# Altium schematic sheet ui.SchDoc
size B; SheetNumber: 6; SheetTotal: 6
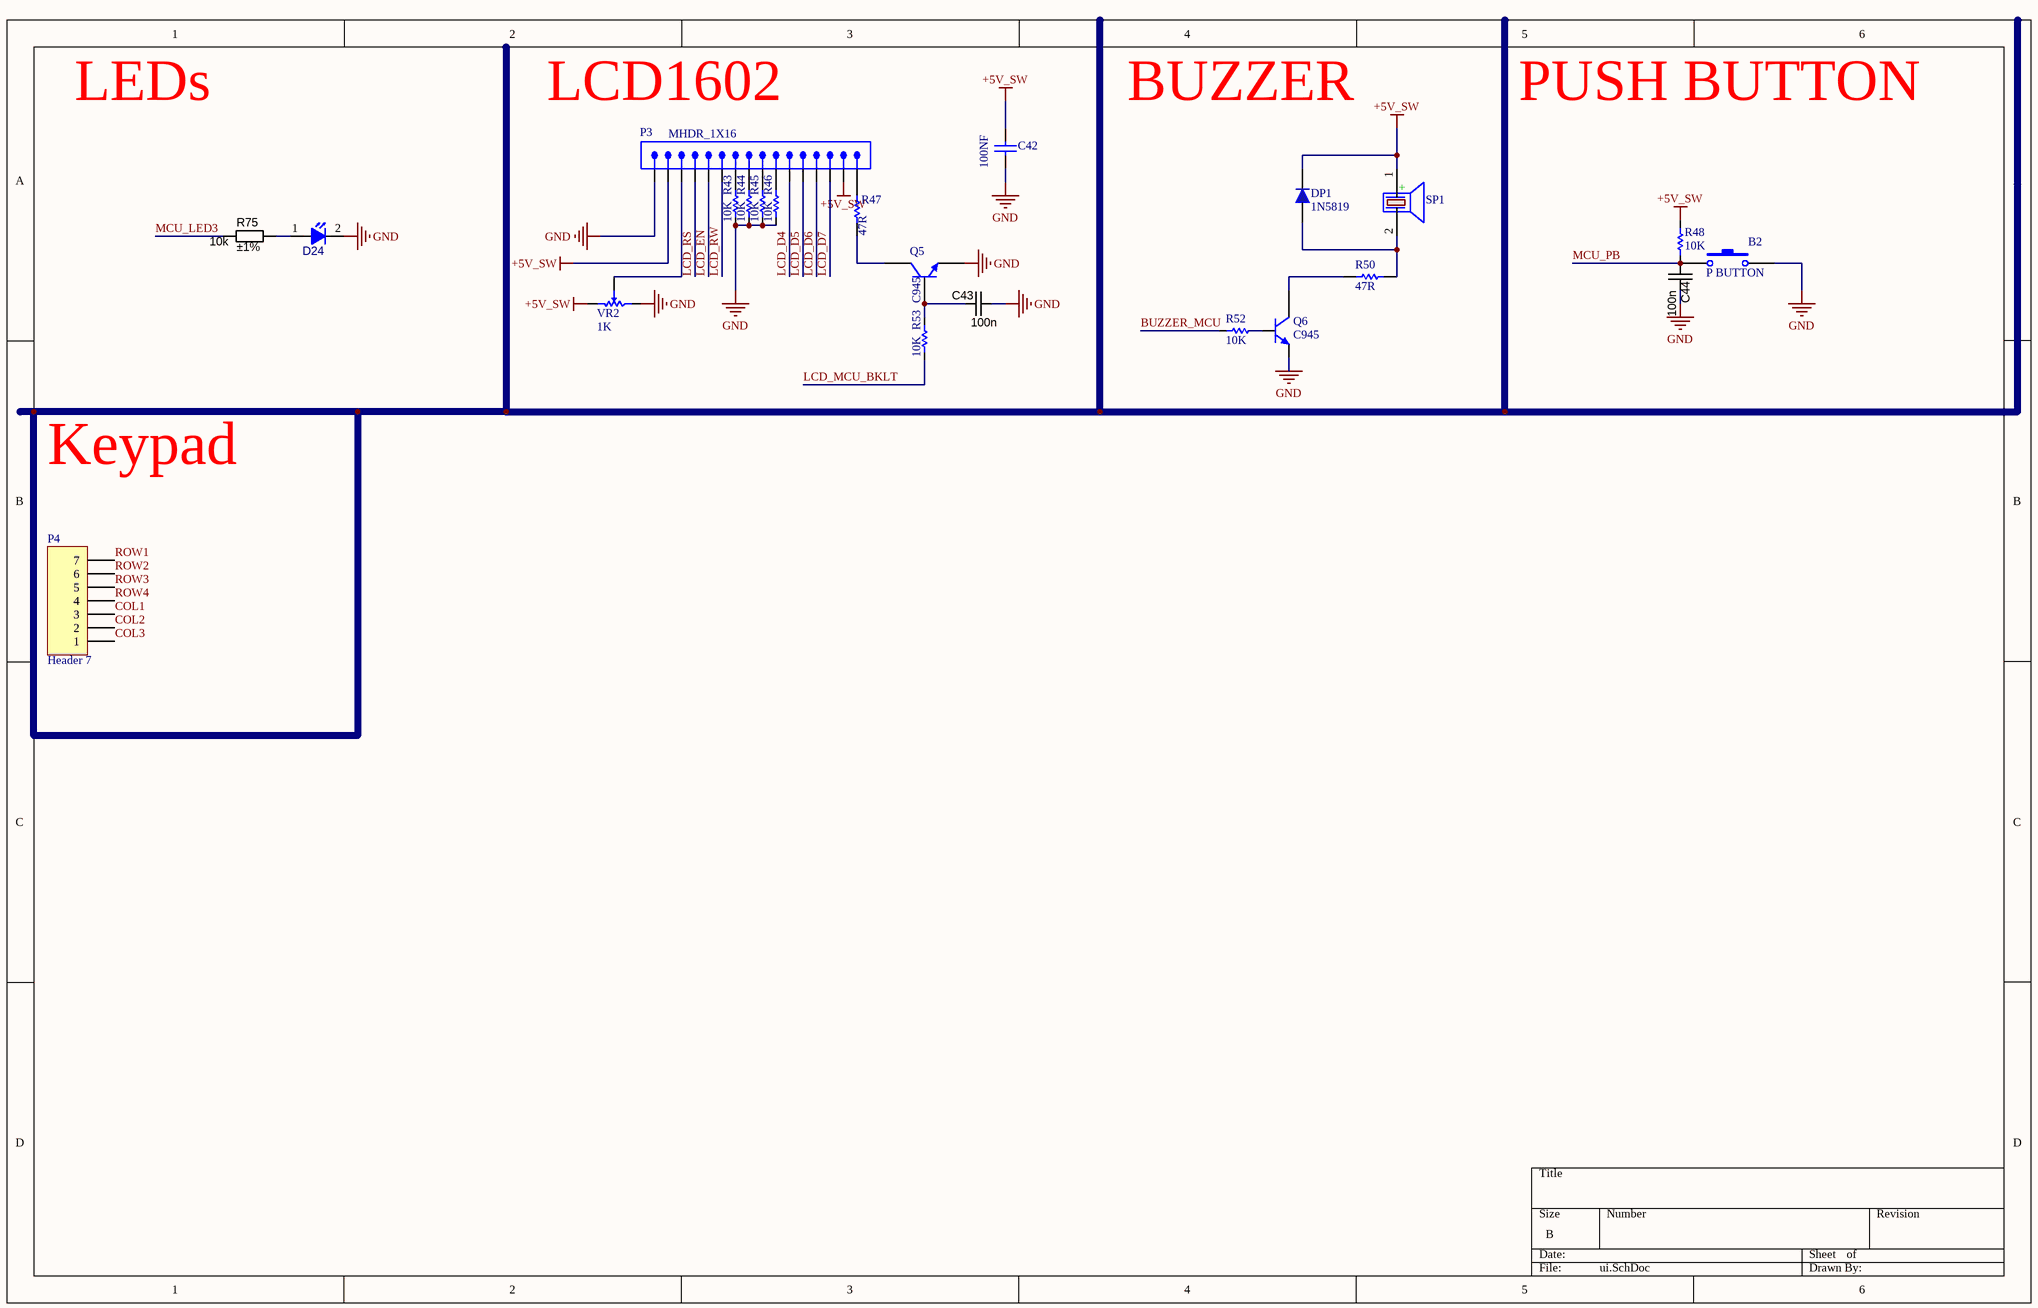
[diagram p0: ui.SchDoc]

## Parts
B2  P BUTTON  [MY_SPST-0.5]
C42  100NF  [CAP0603]
C43  value 100n  [CAPC2012X135N]  (hidden comment: approved sub OK)
C44  value 100n  [CAPC2012X135N]  (hidden comment: approved sub OK)
D24  LED SMD 0603  [LED SMD 0603 2 (Green)]  (value not drawn)
DP1  1N5819  [430X270D]
P3  MHDR_1X16  [MHDR1X16-254P]
P4  Header 7  [HDR1X7]
Q5  C945  [SOT23_N]
Q6  C945  [SOT23_N]
R43  10K  [RES 0603 (1608X06L)]
R44  10K  [RES 0603 (1608X06L)]
R45  10K  [RES 0603 (1608X06L)]
R46  10K  [RES 0603 (1608X06L)]
R47  47R  [RES1206]
R48  10K  [RES 0603 (1608X06L)]
R50  47R  [RES1206]
R52  10K  [RES 0603 (1608X06L)]
R53  10K  [RES 0603 (1608X06L)]
R75  10k  Tolerance: ±1%  [RESC1608X55N]
SP1  (no value)  [BUZZER 7.62mm DC]
VR2  value 1K  [Multi Turn]  (hidden comment: Multi Turn)

## Nets
+5V_SW: C42.2 DP1.2 P3.2 P3.15 R48.1 SP1.1(+) VR2.2(CW)
GND: B2.2 C42.1 C43.1 C44.1 D24.2(CATHODE) P3.1 Q5.2(E) Q6.2(E) R43.1 R44.1 R45.1 R46.1 VR2.1(CCW)
BUZZER_MCU: R52.1
COL1: P4.3
COL2: P4.2
COL3: P4.1
LCD_D4: P3.11
LCD_D5: P3.12
LCD_D6: P3.13
LCD_D7: P3.14
LCD_EN: P3.5
LCD_MCU_BKLT: R53.1
LCD_RS: P3.4
LCD_RW: P3.6
MCU_LED3: R75.1
MCU_PB: B2.1 C44.2 R48.2
ROW1: P4.7
ROW2: P4.6
ROW3: P4.5
ROW4: P4.4
NetC43_2: C43.2 Q5.1(B) R53.2
NetD24_1: D24.1(ANODE) R75.2
NetDP1_1: DP1.1 R50.2 SP1.2(-)
NetP3_3: P3.3 VR2.3(Setpoint)
NetP3_7: P3.7 R43.2
NetP3_8: P3.8 R44.2
NetP3_9: P3.9 R45.2
NetP3_10: P3.10 R46.2
NetP3_16: P3.16 R47.2
NetQ5_3: Q5.3(C) R47.1
NetQ6_1: Q6.1(B) R52.2
NetQ6_3: Q6.3(C) R50.1

## Notes on the sheet
- LEDs
- LCD1602
- BUZZER
- PUSH BUTTON
- Keypad

## Library data of the parts
B2 = PUSH BUTTON_SMALL
C42 = CAP SMD PACKAGE: TOTAL CAPACITOR SMD PACK; Designer: Abbas Basereh; Desc.: CAP SMD TOTAL PACKAGES; Data: 2017-3-10; VALUE: 100nF
C43 C44 = CAPC_100n_0805_X7R_50V_10%: Capacitor SMD Cer 100nF 10% 50V X7R 0805; Manufacturer 1: Kemet; Manufacturer Part Number 1: C0805C104K5RACTU; Ratings: 50V; X7R; Material: ceramic; SCDType: undef; Package / Case: 0805 (2012 metric); Tolerance: ±10%; Supplier 1: Digi-Key; Supplier Part Number 1: 399-1170-1-ND
DP1 = 1N5819: Schottkey Rectifiers; Designer: Abbas Basereh; Data: 16-12-2016; Link: *; Part. No: *
P3 = MHDR_1X16: Male Header 1X16
P4 = Header 7: Header, 7-Pin; LatestRevisionDate: 17-Jul-2002; LatestRevisionNote: Re-released for DXP Platform.; Publisher: Altium Limited
Q5 Q6 = C945: NPN Silicon Epitaxial Planar Transistor; Published: 2017-2-8; LatestRevisionDate: 2017; LatestRevisionNote: IPC-7351 Footprint Added.; DatasheetVersion: 2017; PackageVersion: 2017-2-8; PackageReference: SOT23; Publisher: Abbas Basereh; PackageDescription: 3-Pin SOT-23 Package 0.95 mm Pitch, 2.3 mm Lead Span; ComponentLink1Description: Manufacturer Link; ComponentLink1URL: http://www.taitroncomponents.com/; ComponentLink2Description: Datasheet; ComponentLink2URL: http://www.taitroncomponents.com/
R43-R46 R48 R52 R53 = Resistor: Tolerance: 5%; Power: 1/4 W; Value: 10K
R47 R50 = RES SMD PACKAGE: TOTAL SMD RESISTOR PACK; Designer: Abbas Basereh; Desc.: RES SMD PAKAGES; VALUE: 1K; Data: 2017-3-10
R75 = RES_1K_0603_1%: Resistor SMD chip 1k Ohm 0.1W 1% 0603; Manufacturer 1: Yageo; Manufacturer Part Number 1: RC0603FR-071KL; Ratings: 1/10W; SCDType: spec; Package / Case: 0603 (1608 Metric); Supplier 1: Digi-Key; Supplier Part Number 1: 311-1.00KHRCT-ND; Value: 1K
SP1 = PIEZO BUZZER: PIEZO BUZZER ACTIVE; Designer: Abbas Basereh; Comment_1: SPEAKER AND BEEP; Design Date: 1395/11/14; ComponentLink2Description: Reference; PackageDescription: THD; Publisher: Abbas Basereh; Mounting Technology: THD; Pin Count: 2; Status: Unreleased
VR2 = Multi Turn: Email: Razi.vesali@gmail.com; LatestRevisionDate: 17-Jul-2016; LatestRevisionNote: Re-released for Puplic; Publisher: Seyed Razi vesali (SRV)
D24 = LED SMD 0603: ComponentLink1Description: Tarahiboard; ComponentLink1URL: https://www.tarahiboard.com/product/library-pack; DatasheetVersion: 2022